# Altium schematic sheet AS608.SchDoc
size A4
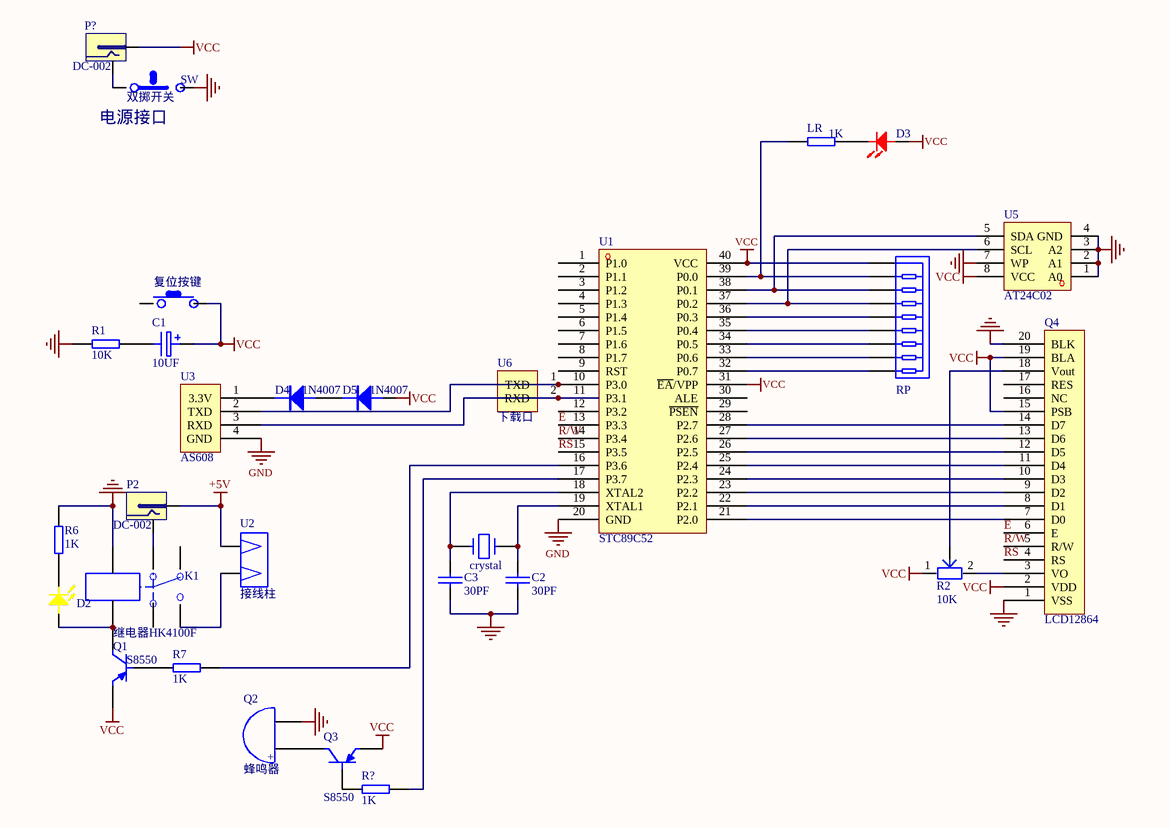
[diagram p0: AS608.SchDoc]

## Parts
?  crystal  [XTAL]
C1  10UF  [CD4]
C2  30PF  [R38]
C3  30PF  [R38]
D2  LED-YELLOW  [LED-YELLOW]  (value not drawn)
D3  LED-RED  [LED-RED]  (value not drawn)
D4  1N4007  [DO-41]
D5  1N4007  [DO-41]
K1  继电器HK4100F  [HK4100F]
KEY?  复位按键  [SW]
LR  1K  [AXIAL-0.3]
P2  DC-002  [DC-005]
P?  DC-002  [DC-002]
Q1  S8550  [三极管]
Q2  蜂鸣器  [蜂鸣器]
Q3  S8550  [三极管]
Q4  LCD12864  [HDR20]
R1  10K  [AXIAL-0.4]
R2  10K  [Res-JT]
R6  1K  [AXIAL-0.3]
R7  1K  [AXIAL-0.3]
R?  1K  [AXIAL-0.3]
RP  10k  [R*9]  (value not drawn)
SW  双掷开关  [SS12D07G5]
U1  STC89C52  [DIP40]
U2  接线柱  [XH2P]
U3  AS608  [XH4P]
U5  AT24C02  [DIP8]
U6  下载口  [HDR2]

## Nets
+5V: P2.1 U2.2
GND: C2.1 C3.2 K1.5 Q2.2 Q4.1(VSS) Q4.20(BLK) R1.1 R6.1 SW.2 U1.20(GND) U3.4(GND) U5.1(A0) U5.2(A1) U5.3(A2) U5.4(GND) U5.7(WP)
VCC: C1.1 D3.1 D5.1 KEY?.2 P?.1 Q1.1(E) Q3.1(E) Q4.2(VDD) Q4.15(PSB) Q4.19(BLA) R2.1 RP.1 U1.31(~{EA}/VPP) U1.40(VCC) U5.8(VCC)
E: Q4.6(E) U1.13(P3.3)
R/W: Q4.5(R/W) U1.14(P3.4)
RS: Q4.4(RS) U1.15(P3.5)
Net?_1: ?.1 C2.2 U1.19(XTAL1)
Net?_2: ?.2 C3.1 U1.18(XTAL2)
NetC1_2: C1.2(E) R1.2
NetD2_1: D2.1 K1.2 Q1.3(C)
NetD2_2: D2.2 R6.2
NetD3_2: D3.2 LR.1
NetD4_1: D4.1 D5.2
NetD4_2: D4.2 U3.1(3.3V)
NetK1_4: K1.4 U2.1
NetK1_6: K1.6 P2.2
NetLR_2: LR.2 RP.2 U1.39(P0.0)
NetP?_2: P?.2 SW.1
NetQ1_2: Q1.2(B) R7.1
NetQ2_1: Q2.1 Q3.3(C)
NetQ3_2: Q3.2(B) R?.1
NetQ4_3: Q4.3(VO) R2.2
NetQ4_7: Q4.7(D0) U1.21(P2.0)
NetQ4_8: Q4.8(D1) U1.22(P2.1)
NetQ4_9: Q4.9(D2) U1.23(P2.2)
NetQ4_10: Q4.10(D3) U1.24(P2.3)
NetQ4_11: Q4.11(D4) U1.25(P2.4)
NetQ4_12: Q4.12(D5) U1.26(P2.5)
NetQ4_13: Q4.13(D6) U1.27(P2.6)
NetQ4_14: Q4.14(D7) U1.28(P2.7)
NetQ4_18: Q4.18(Vout) R2.3
NetR7_2: R7.2 U1.16(P3.6)
NetR?_2: R?.2 U1.17(P3.7)
NetRP_3: RP.3 U1.38(P0.1) U5.5(SDA)
NetRP_4: RP.4 U1.37(P0.2) U5.6(SCL)
NetRP_5: RP.5 U1.36(P0.3)
NetRP_6: RP.6 U1.35(P0.4)
NetRP_7: RP.7 U1.34(P0.5)
NetRP_8: RP.8 U1.33(P0.6)
NetRP_9: RP.9 U1.32(P0.7)
NetU1_10: U1.10(P3.0) U3.2(TXD) U6.1(TXD)
NetU1_11: U1.11(P3.1) U3.3(RXD) U6.2(RXD)

Not connected (* = marked no-connect by the designer): K1 1 3; KEY? 1(3); Q4 16(NC) 17(RES); U1 1(P1.0) 2(P1.1) 3(P1.2) 4(P1.3) 5(P1.4) 6(P1.5) 7(P1.6) 8(P1.7) 9(RST) 12(P3.2) 29(~{PSEN}) 30(ALE)

## Notes on the sheet
- (near SW) 电源接口
- (in symbol 蜂鸣器) +

## Library data of the parts
? = XTAL
C1 = 电解电容
C2 C3 = 瓷片电容
KEY? = 微动开关
LR R1 R6 R7 R? = RES
R2 = 电位器
RP = 排阻